# EasyEDA Pro project ProPrj_CWATCH_2025-07-30.epro, schematic Schematic1
Board Name: Board1; Create Date: 2025-07-17; Page Name: P1; Project Name: CWATCH; Schematic Name: Schematic1; Update Date: 2025-07-28; Company: EasyEDA.com; Page Size: A4; Version: V1.0
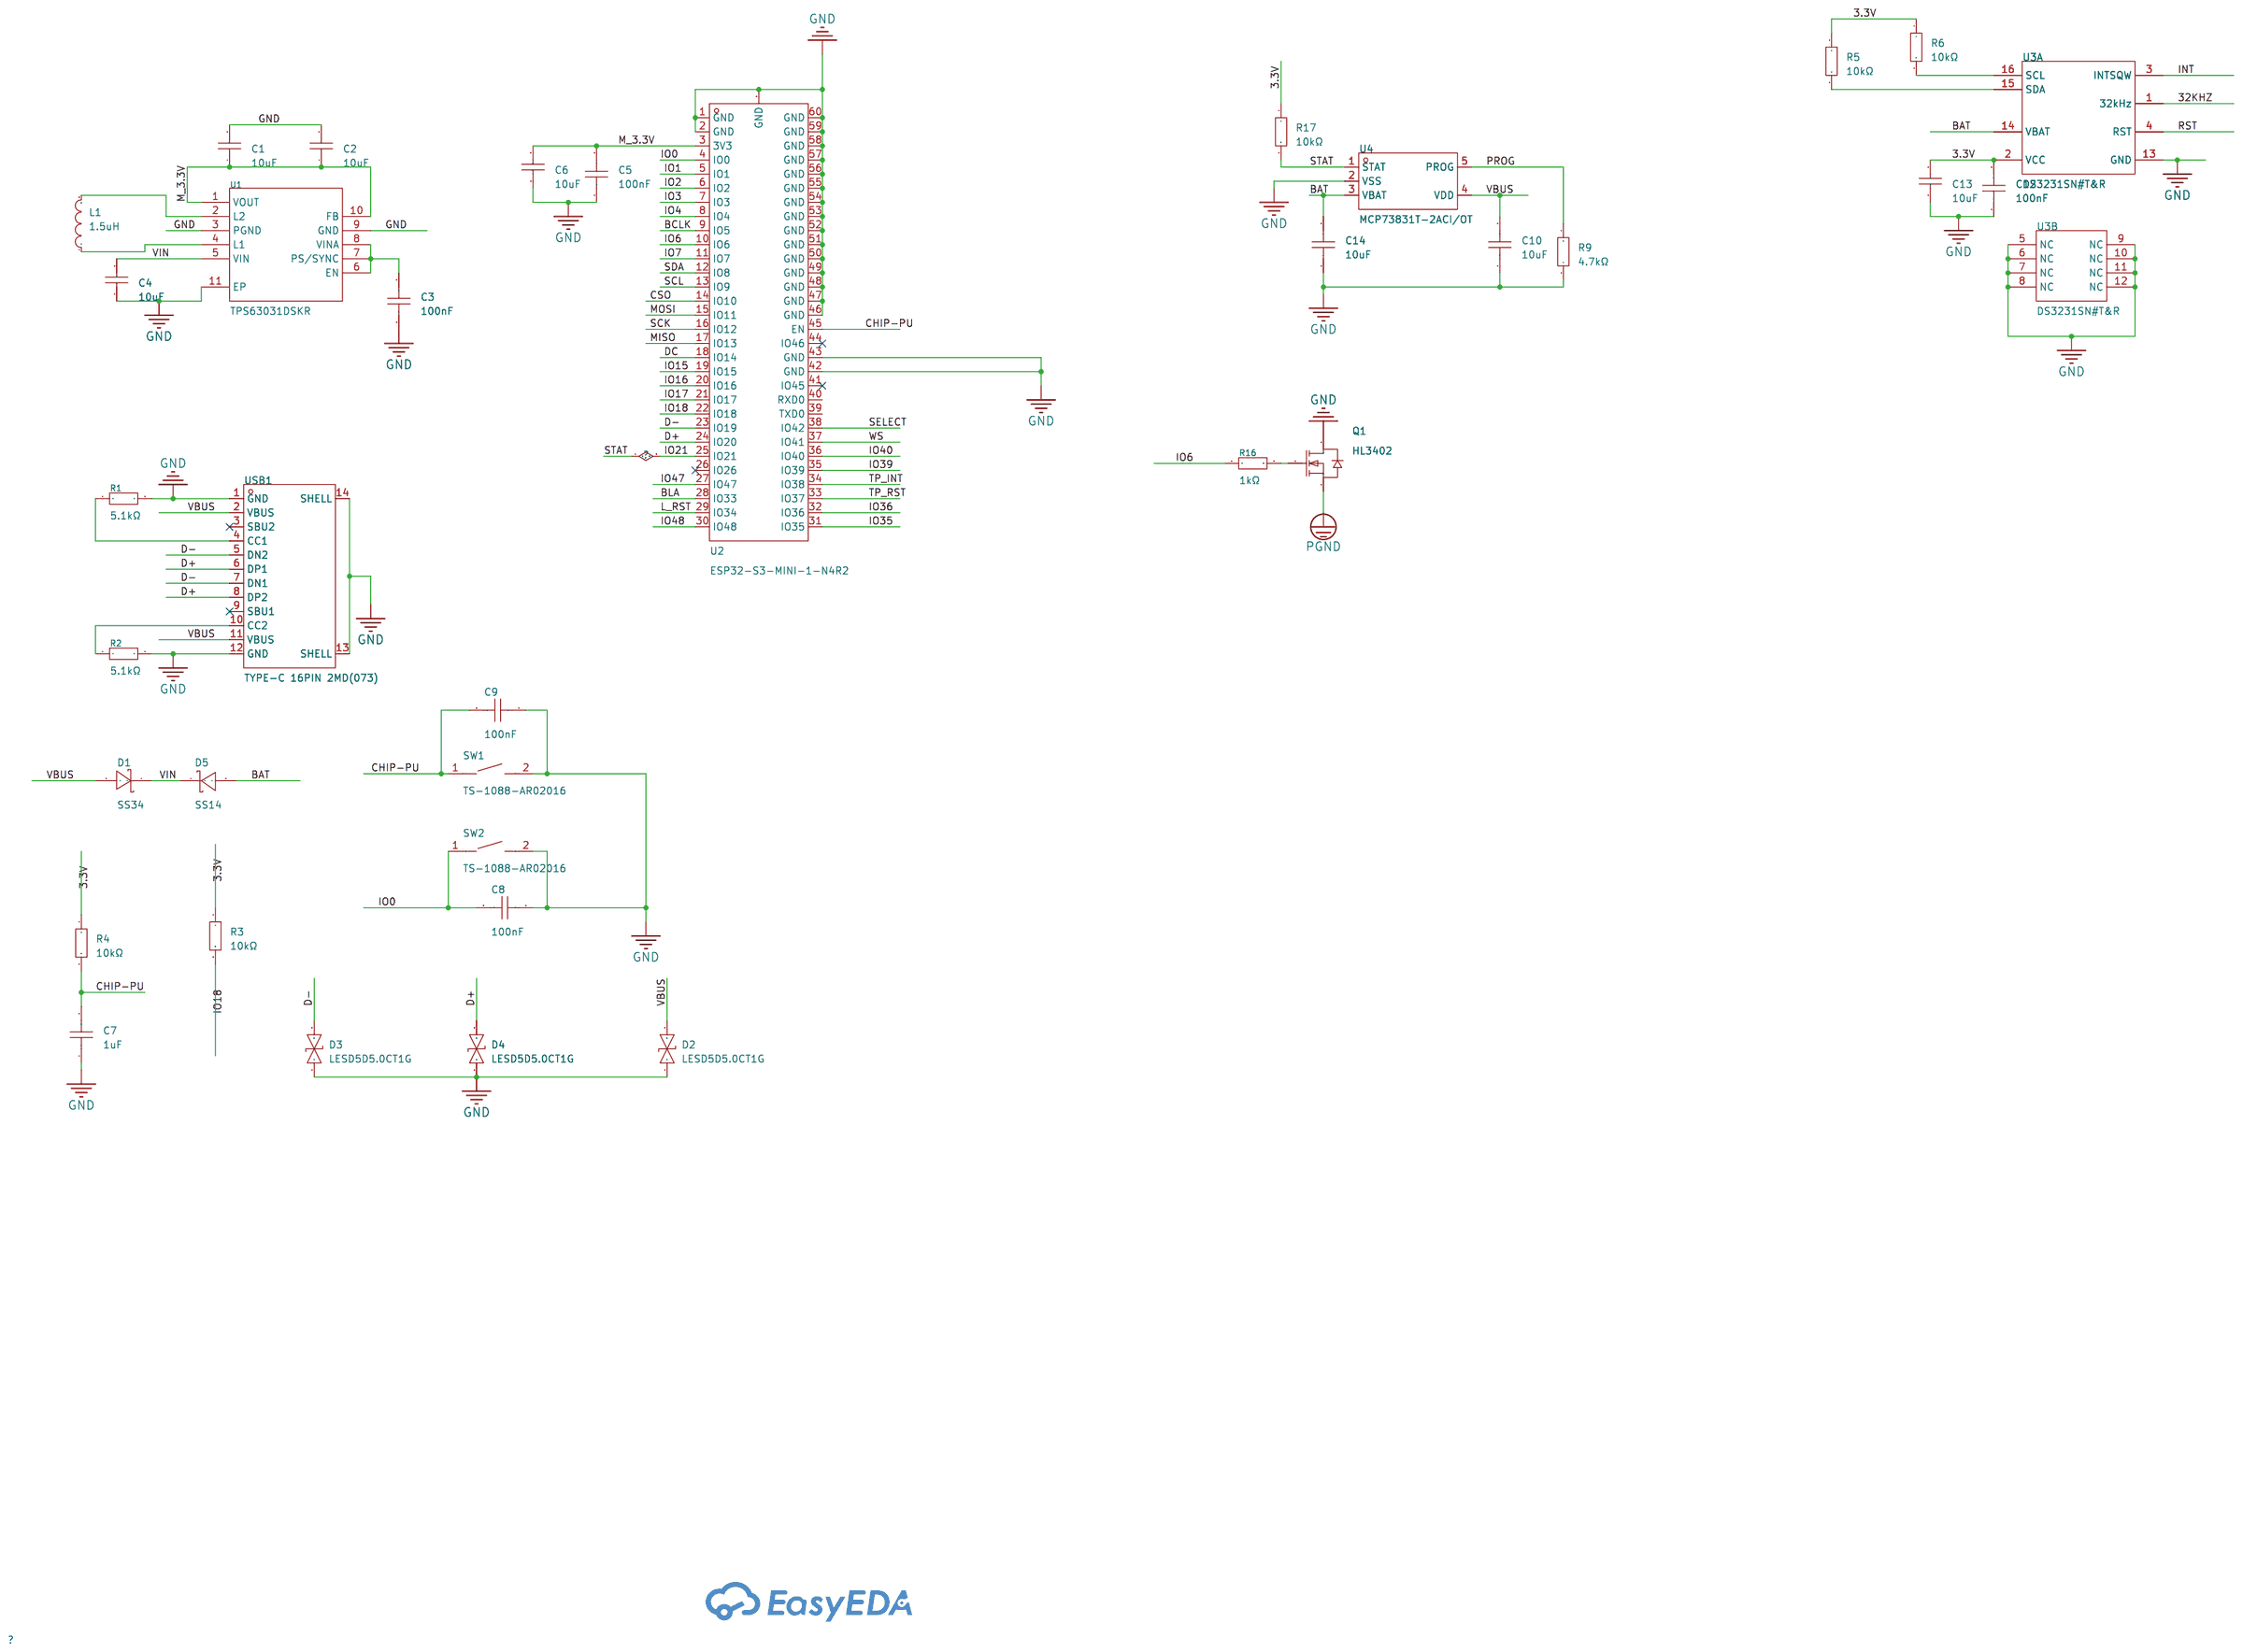
[diagram p1: schematic sheet]

## Parts
C1  10uF  [C0402]
C2  10uF  [C0402]
C3  100nF  [C0402]
C4  10uF  [C0402]
C5  100nF  [C0402]
C6  10uF  [C0402]
C7  1uF  [C0402]
C8  100nF  [C0402]
C9  100nF  [C0402]
C10  10uF  [C0603]
C12  100nF  [C0402]
C13  10uF  [C0402]
C14  10uF  [C0603]
D1  SS34  [SMA_L4.3-W2.6-LS5.2-RD]
D2  LESD5D5.0CT1G  [SOD-523_L1.2-W0.8-LS1.6-BI]
D3  LESD5D5.0CT1G  [SOD-523_L1.2-W0.8-LS1.6-BI]
D4  LESD5D5.0CT1G  [SOD-523_L1.2-W0.8-LS1.6-BI]
D5  SS14  [SMA_L4.2-W2.6-LS5.0-RD_1]
L1  1.5uH  [IND-SMD_L4.4-W4.2]
Q1  HL3402  [SOT-23-3_L2.9-W1.3-P1.90-LS2.4-BR]
R1  5.1kΩ  [R0402]
R2  5.1kΩ  [R0402]
R3  10kΩ  [R0402]
R4  10kΩ  [R0402]
R5  10kΩ  [R0402]
R6  10kΩ  [R0402]
R9  4.7kΩ  [R0603]
R16  1kΩ  [R0402]
R17  10kΩ  [R0402]
SW1  TS-1088-AR02016  [SW-SMD_L3.9-W3.0-P4.45]
SW2  TS-1088-AR02016  [SW-SMD_L3.9-W3.0-P4.45]
U1  TPS63031DSKR  [SON-10_L2.5-W2.5-P0.50-TL-EP]
U2  ESP32-S3-MINI-1-N4R2  [BULETM-SMD_ESP32-S3-MINI-1-N8]
U3  DS3231SN#T&R  [SOIC-16_L10.3-W7.5-P1.27-LS10.3-BL]  (sections 1,2)
U4  MCP73831T-2ACI/OT  [SOT-23-5_L3.0-W1.7-P0.95-LS2.8-BL]
USB1  TYPE-C 16PIN 2MD(073)  [USB-C-SMD_TYPE-C-6PIN-2MD-073]

## Library data of the parts
C1 C2 C4 C6 C13 = CL05A106MQ5NUNC: Capacitance: Tolerance:±20% Tolerance:±20% Voltage Rated: Temperature Coefficient:; LCSC Part Name: 10uF ±20% 6.3V; Supplier Part: C15525; Manufacturer: SAMSUNG(三星); Supplier Footprint: 0402; JLCPCB Part Class: Basic Part; Datasheet: https://atta.szlcsc.com/upload/public/pdf/source/20220823/2B02EE04F8F211D38A52DCB16EB6BEBA.pdf; Supplier: LCSC; Tolerance: ±20%
C3 C5 C8 C9 C12 = CL05B104KO5NNNC: Capacitance: Tolerance:±10% Tolerance:±10% Voltage Rated: Temperature Coefficient:; LCSC Part Name: 100nF ±10% 16V; Supplier Part: C1525; Manufacturer: SAMSUNG(三星); Supplier Footprint: 0402; JLCPCB Part Class: Basic Part; Datasheet: https://atta.szlcsc.com/upload/public/pdf/source/20160218/1457707763339.pdf; Supplier: LCSC; Tolerance: ±10%
C7 = CL05A105KA5NQNC: Capacitance: Tolerance:±10% Tolerance:±10% Voltage Rated: Temperature Coefficient:; LCSC Part Name: 1uF ±10% 25V; Supplier Part: C52923; Manufacturer: SAMSUNG(三星); Supplier Footprint: 0402; JLCPCB Part Class: Basic Part; Datasheet: https://atta.szlcsc.com/upload/public/pdf/source/20160218/1457707763339.pdf; Supplier: LCSC; Tolerance: ±10%
C10 C14 = CL10A106KP8NNNC: Capacitance: Tolerance:±10% Tolerance:±10% Voltage Rated: Temperature Coefficient:; LCSC Part Name: 10uF ±10% 10V; Supplier Part: C19702; Manufacturer: SAMSUNG(三星); Supplier Footprint: 0603; JLCPCB Part Class: Basic Part; Datasheet: https://atta.szlcsc.com/upload/public/pdf/source/20160218/1457707763339.pdf; Supplier: LCSC; Tolerance: ±10%
D1 = SS34_C8678: Diode Configuration:Independent Type Forward Voltage (Vf@If):550mV@3A Reverse Voltage (Vr):40V Rectified Current:3A Reverse Leakage Current (Ir):500uA@40V; LCSC Part Name: 电压:40V 电流:3A; Supplier Part: C8678; Manufacturer: MDD(辰达半导体); Supplier Footprint: SMA(DO-214AC); JLCPCB Part Class: Basic Part; Datasheet: https://atta.szlcsc.com/upload/public/pdf/source/20240710/2118BB86FDDB2E0B294389AC1F3F65C8.pdf; Supplier: LCSC; Diode Configuration: Independent Type; Forward Voltage (Vf@If): 550mV@3A; Reverse Voltage (Vr): 40V; Rectified Current: 3A; Reverse Leakage Current (Ir): 500uA@40V
D2-D4 = LESD5D5.0CT1G: polarity:Bidirectional Reverse Stand-Off Voltage (Vrwm):5V Maximum Clamping Voltage:18.6V Peak Pulse Current (Ipp):9.4A Breakdown Voltage:5.6V Type:ESD; LCSC Part Name: 双向ESD; Supplier Part: C383211; Manufacturer: LRC(乐山无线电); Supplier Footprint: SOD-523; JLCPCB Part Class: Extended Part; Datasheet: https://atta.szlcsc.com/upload/public/pdf/source/20190807/C383211_633DF4B4E2C161403226E5235FE33A1C.pdf; Supplier: LCSC; polarity: Bidirectional; Reverse Stand-Off Voltage (Vrwm): 5V; Maximum Clamping Voltage: 18.6V; Peak Pulse Current (Ipp): 9.4A; Breakdown Voltage: 5.6V; Type: ESD
D5 = SS14_C2480: Diode Configuration:Independent Voltage - Forward(Vf@If):550mV@1A Voltage - DC Reverse(Vr):40V Current - Rectified:1A Reverse Leakage Current (Ir):300uA@40V; LCSC Part Name: 电压:40V 电流:1A; Supplier Part: C2480; Manufacturer: MDD(辰达半导体); Supplier Footprint: SMA(DO-214AC); JLCPCB Part Class: Basic Part; Datasheet: https://atta.szlcsc.com/upload/public/pdf/source/20241121/B157EB417161760A7ED23035C0FAAB28.pdf; Supplier: LCSC; Diode Configuration: Independent; Voltage - Forward(Vf@If): 550mV@1A; Voltage - DC Reverse(Vr): 40V; Current - Rectified: 1A; Reverse Leakage Current (Ir): 300uA@40V
L1 = SLO0420H1R5MTT: Inductance:1.5uH Tolerance:±20% Tolerance:±20% Current Rating:- DC Resistance(DCR):-; LCSC Part Name: 1.5uH ±20%; Supplier Part: C207827; Manufacturer: Sunltech(顺磁); Supplier Footprint: SMD; JLCPCB Part Class: Extended Part; Datasheet: https://atta.szlcsc.com/upload/public/pdf/source/20180412/C207832_AC02695E18CA38D7B5E2858AA75468CE.pdf; Supplier: LCSC; Tolerance: ±20%
Q1 = HL3402: Type:1 N-channel Drain to Source Voltage:30V Current - Continuous Drain(Id): RDS(on):58mΩ@4.5V,2.5A Pd - Power Dissipation: Gate Threshold Voltage (Vgs(th)@Id):650mV Gate Charge(Qg):5nC@10V Input Capacitance(Ciss@Vds):390pF Reverse Transfer Capacitance (C; LCSC Part Name: N沟道MOSFET,电流:2.5A,耐压:30V; Supplier Part: C28646271; Manufacturer: 宏嘉诚; Supplier Footprint: SOT-23; JLCPCB Part Class: Extended Part; Datasheet: https://atta.szlcsc.com/upload/public/pdf/source/20250106/3CBB25DF20D257973C4B9F3CB20D1817.pdf; Supplier: LCSC; Type: 1 N-channel; Drain to Source Voltage: 30V; RDS(on): 58mΩ@4.5V,2.5A; Gate Threshold Voltage (Vgs(th)@Id): 650mV; Gate Charge(Qg): 5nC@10V; Input Capacitance(Ciss@Vds): 390pF; Reverse Transfer Capacitance (Crss@Vds): 41pF@15V; Operating Temperature: -55℃~+150℃
R1 R2 = 0402WGF5101TCE: Type:Thick Film Resistors Resistance:5.1kΩ Tolerance:±1% Tolerance:±1% Power(Watts): Overload Voltage (Max): Temperature Coefficient:±100ppm/℃ Temperature Coefficient:±100ppm/℃ Operating Temperature Range:-55℃~+155℃ Operating Temperature Range:-55℃~+155℃; LCSC Part Name: 5.1kΩ ±1% 62.5mW 厚膜电阻; Supplier Part: C25905; Manufacturer: UNI-ROYAL(厚声); Supplier Footprint: 0402; JLCPCB Part Class: Basic Part; Datasheet: https://atta.szlcsc.com/upload/public/pdf/source/20200306/C422600_1E6D84923E4A46A82E41ADD87F860B5C.pdf; Supplier: LCSC; Type: Thick Film Resistors; Tolerance: ±1%; Temperature Coefficient: ±100ppm/℃; Operating Temperature Range: -55℃~+155℃
R3-R6 R17 = 0402WGF1002TCE: Type:Thick Film Resistors Resistance:10kΩ Tolerance:±1% Tolerance:±1% Power(Watts): Overload Voltage (Max): Temperature Coefficient:±100ppm/℃ Temperature Coefficient:±100ppm/℃ Operating Temperature Range:-55℃~+155℃ Operating Temperature Range:-55℃~+155℃; LCSC Part Name: 10kΩ ±1% 62.5mW 厚膜电阻; Supplier Part: C25744; Manufacturer: UNI-ROYAL(厚声); Supplier Footprint: 0402; JLCPCB Part Class: Basic Part; Datasheet: https://atta.szlcsc.com/upload/public/pdf/source/20200306/C422600_1E6D84923E4A46A82E41ADD87F860B5C.pdf; Supplier: LCSC; Type: Thick Film Resistors; Tolerance: ±1%; Temperature Coefficient: ±100ppm/℃; Operating Temperature Range: -55℃~+155℃
R9 = 0603WAF4701T5E: Type:Thick Film Resistors Resistance:4.7kΩ Tolerance:±1% Tolerance:±1% Power(Watts): Overload Voltage (Max): Temperature Coefficient:±100ppm/℃ Temperature Coefficient:±100ppm/℃ Operating Temperature Range:-55℃~+155℃ Operating Temperature Range:-55℃~+155℃; LCSC Part Name: 4.7kΩ ±1% 100mW 厚膜电阻; Supplier Part: C23162; Manufacturer: UNI-ROYAL(厚声); Supplier Footprint: 0603; JLCPCB Part Class: Basic Part; Datasheet: https://atta.szlcsc.com/upload/public/pdf/source/20200306/C422600_1E6D84923E4A46A82E41ADD87F860B5C.pdf; Supplier: LCSC; Type: Thick Film Resistors; Tolerance: ±1%; Temperature Coefficient: ±100ppm/℃; Operating Temperature Range: -55℃~+155℃
R16 = 0402WGF1001TCE: Type:Thick Film Resistors Resistance:1kΩ Tolerance:±1% Tolerance:±1% Power(Watts): Overload Voltage (Max): Temperature Coefficient:±100ppm/℃ Temperature Coefficient:±100ppm/℃ Operating Temperature Range:-55℃~+155℃ Operating Temperature Range:-55℃~+155℃; LCSC Part Name: 1kΩ ±1% 62.5mW 厚膜电阻; Supplier Part: C11702; Manufacturer: UNI-ROYAL(厚声); Supplier Footprint: 0402; JLCPCB Part Class: Basic Part; Datasheet: https://atta.szlcsc.com/upload/public/pdf/source/20200306/C422600_1E6D84923E4A46A82E41ADD87F860B5C.pdf; Supplier: LCSC; Type: Thick Film Resistors; Tolerance: ±1%; Temperature Coefficient: ±100ppm/℃; Operating Temperature Range: -55℃~+155℃
SW1 SW2 = TS-1088-AR02016: Circuit:SPST Actuator Style:Round Button Operating Force:160gf Mounting Style:Brick nogging Switch Length:4mm Switch Width:3mm Switch Height:2mm Strike Gundam:不带 Contact Current:50mA Voltage Rating (DC):12V Insulation Resistance:100MΩ Actuator/Cap Color:B; LCSC Part Name: 4*3*2mm 立贴 轻触开关; Supplier Part: C720477; Manufacturer: XUNPU(讯普); Supplier Footprint: SMD; JLCPCB Part Class: Basic Part; Datasheet: https://atta.szlcsc.com/upload/public/pdf/source/20200810/C720475_60D09DD6C54279ADDB2DC25100F1CC11.pdf; Supplier: LCSC; Circuit: SPST; Actuator Style: Round Button; Operating Force: 160gf; Mounting Style: Brick nogging; Switch Length: 4mm; Switch Width: 3mm; Switch Height: 2mm; Strike Gundam: 不带; Contact Current: 50mA; Voltage Rating (DC): 12V; Insulation Resistance: 100MΩ; Actuator/Cap Color: Black; Pin Style: SMDSplicing; Mechanical Life: 10万次; Operating Temperature: -30℃~+80℃
U1 = TPS63031DSKR: Function:Boost type Output Type:- Voltage - Supply:1.8V~5.5V Voltage - Supply:1.8V~5.5V Output Voltage:3.3V Output Voltage:3.3V Output Current:900mA Frequency - Switching:2.4MHz Frequency - Switching:2.4MHz Operating Temperature:-40℃~+125℃@(TJ) Operating; Supplier Part: C15516; Manufacturer: TI(德州仪器); Supplier Footprint: SON-10-EP(2.5x2.5); JLCPCB Part Class: Extended Part; Datasheet: https://www.ti.com/cn/lit/gpn/tps63031; Supplier: LCSC; Function: Boost type; Voltage - Supply: 1.8V~5.5V; Output Voltage: 3.3V; Output Current: 900mA; Frequency - Switching: 2.4MHz; Operating Temperature: -40℃~+125℃@(TJ); Synchronous Rectifier: Yes; Number of Outputs: 1; Topology: Step-down-Boost; Switch tube (built-in/external): Built-in
U2 = ESP32-S3-MINI-1-N4R2: Antenna Type:On-Board PCB Antenna; Supplier Part: C3013941; Manufacturer: ESPRESSIF(乐鑫); Supplier Footprint: SMD; JLCPCB Part Class: Extended Part; Supplier: LCSC; Antenna Type: On-Board PCB Antenna
U3 = DS3231SN#T&R: Interface:I2C Voltage - Supply:2.3V~5.5V Voltage - Supply:2.3V~5.5V Operating Temperature:-40℃~+85℃ Operating Temperature:-40℃~+85℃; LCSC Part Name: 超高精度、I²C接口、集成RTC/TCXO/晶体; Supplier Part: C9866; Manufacturer: ADI(亚德诺)/MAXIM(美信); Supplier Footprint: SOIC-16-300mil; JLCPCB Part Class: Extended Part; Datasheet: https://atta.szlcsc.com/upload/public/pdf/source/20121112/1457706556491.pdf; Supplier: LCSC; Interface: I2C; Voltage - Supply: 2.3V~5.5V; Operating Temperature: -40℃~+85℃
U4 = MCP73831T-2ACI/OT: The Chip Type:- Voltage - Supply:3.75V~6V Voltage - Supply:3.75V~6V Charge Current - Max:- Charging Saturation Voltage:4.2V Type of Battery:Lithium-ion/Polymer Number of Cells:1 Number of Cells:1 Operating Temperature:-40℃~+85℃ Operating Temperature:-40℃~; Supplier Part: C424093; Manufacturer: MICROCHIP(美国微芯); Supplier Footprint: SOT-23-5; JLCPCB Part Class: Extended Part; Datasheet: https://atta.szlcsc.com/upload/public/pdf/source/20190902/C424093_BB3CBFD6F009A8554318004A07DA97EE.pdf; Supplier: LCSC; Voltage - Supply: 3.75V~6V; Charging Saturation Voltage: 4.2V; Type of Battery: Lithium-ion/Polymer; Number of Cells: 1; Operating Temperature: -40℃~+85℃
USB1 = TYPE-C 16PIN 2MD(073): Connector Type:Type-C Protocol Standard:USB 3.1 Gender:Female Mounting Type:Surface Mount, Right Angle Number of Contacts:16P Number of Ports:1 Current Rating-Power:3A Voltage Rating:5V Connect-Disconnect Life:5,000 Cycles Supplementary Features:- Center; LCSC Part Name: Type-C 母 卧贴; Supplier Part: C2765186; Manufacturer: SHOU HAN(首韩); Supplier Footprint: SMD; JLCPCB Part Class: Extended Part; Datasheet: https://atta.szlcsc.com/upload/public/pdf/source/20250506/FFB74EDFDFA0AC372CE4A8E4F739CCEF.pdf; Supplier: LCSC; Connector Type: Type-C; Protocol Standard: USB 3.1; Gender: Female; Mounting Type: Surface Mount, Right Angle; Number of Contacts: 16P; Number of Ports: 1; Current Rating-Power: 3A; Voltage Rating: 5V; Connect-Disconnect Life: 5,000 Cycles; Detection color: Black; Operating Temperature: -25℃~+85℃

## Nets
3.3V: C12.2 C13.2 R3.1 R4.1 R5.1 R6.1 R17.1 U3.2(VCC)
GND: C1.2 C2.2 C3.1 C4.1 C5.1 C6.1 C7.1 C8.1 C9.1 C10.1 C12.1 C13.1 C14.1 D2.1 D3.1 D4.1 Q1.3(D) R1.2 R2.2 R9.1 SW1.2 SW2.2 U1.3(PGND) U1.9(GND) U1.11(EP) U2.1(GND) U2.2(GND) U2.42(GND) U2.43(GND) U2.46(GND) U2.47(GND) U2.48(GND) U2.49(GND) U2.50(GND) U2.51(GND) U2.52(GND) U2.53(GND) U2.54(GND) U2.55(GND) U2.56(GND) U2.57(GND) U2.58(GND) U2.59(GND) U2.60(GND) U2.GND U3.5(NC) U3.6(NC) U3.7(NC) U3.8(NC) U3.9(NC) U3.10(NC) U3.11(NC) U3.12(NC) U3.13(GND) U4.2(VSS) USB1.1(GND) USB1.12(GND) USB1.13(SHELL) USB1.14(SHELL)
PGND: Q1.2(S)
VBUS: C10.2 D1.2(A) D2.2 U4.4(VDD) USB1.2(VBUS) USB1.11(VBUS)
VIN: C4.2 D1.1(K) D5.1(K) U1.5(VIN)
32KHZ: U3.1(32kHz)
BAT: C14.2 D5.2(A) U3.14(VBAT) U4.3(VBAT)
BCLK: U2.9(IO5)
BLA: U2.28(IO33)
CHIP-PU: C7.2 C9.2 R4.2 SW1.1 U2.45(EN)
CSO: U2.14(IO10)
D+: D4.2 U2.24(IO20) USB1.6(DP1) USB1.8(DP2)
D-: D3.2 U2.23(IO19) USB1.5(DN2) USB1.7(DN1)
DC: U2.18(IO14)
INT: U3.3(INTSQW)
IO0: C8.2 SW2.1 U2.4(IO0)
IO1: U2.5(IO1)
IO2: U2.6(IO2)
IO3: U2.7(IO3)
IO4: U2.8(IO4)
IO6: R16.1 U2.10(IO6)
IO7: U2.11(IO7)
IO15: U2.19(IO15)
IO16: U2.20(IO16)
IO17: U2.21(IO17)
IO18: R3.2 U2.22(IO18)
IO21: R17.2 U2.25(IO21) U4.1(STAT)
IO35: U2.31(IO35)
IO36: U2.32(IO36)
IO39: U2.35(IO39)
IO40: U2.36(IO40)
IO47: U2.27(IO47)
IO48: U2.30(IO48)
L_RST: U2.29(IO34)
M_3.3V: C1.1 C2.1 C5.2 C6.2 U1.1(VOUT) U1.10(FB) U2.3(3V3)
MISO: U2.17(IO13)
MOSI: U2.15(IO11)
PROG: R9.2 U4.5(PROG)
RST: U3.4(RST)
SCK: U2.16(IO12)
SCL: U2.13(IO9)
SDA: U2.12(IO8)
SELECT: U2.38(IO42)
TP_INT: U2.34(IO38)
TP_RST: U2.33(IO37)
WS: U2.37(IO41)
$1N269: L1.1 U1.4(L1)
$1N274: L1.2 U1.2(L2)
$1N457: C3.2 U1.6(EN) U1.7(PS/SYNC) U1.8(VINA)
$1N1950: R2.1 USB1.10(CC2)
$1N1955: R1.1 USB1.4(CC1)
$1N5966: R5.2 U3.15(SDA)
$1N5970: R6.2 U3.16(SCL)
$1N12715: Q1.1(G) R16.2

Not connected (* = marked no-connect by the designer): U2 26(IO26)* 39(TXD0) 40(RXD0) 41(IO45)* 44(IO46)*; USB1 3(SBU2)* 9(SBU1)*
